# Altium schematic sheet 考勤机指纹密码锁部分原理图.SchDoc: 醉驾锁车系统接收原理图
size A4; PageSetup: Record=PageOptions|CenterHorizontal=True|CenterVertical=True|PrintScale=1.00|XCorrection=1.00|YCorrection=1.00|PrintKind=0|BorderSize=5000000|LeftOffset=0|BottomOffset=0|Orientation=2|PaperLength=1000|PaperWidth=1000|Scale=100|PaperSource=7|PrintQuality=-4|MediaType=1|DitherType=10|PaperKind=A4|PrintScaleMode=0; Time: 1
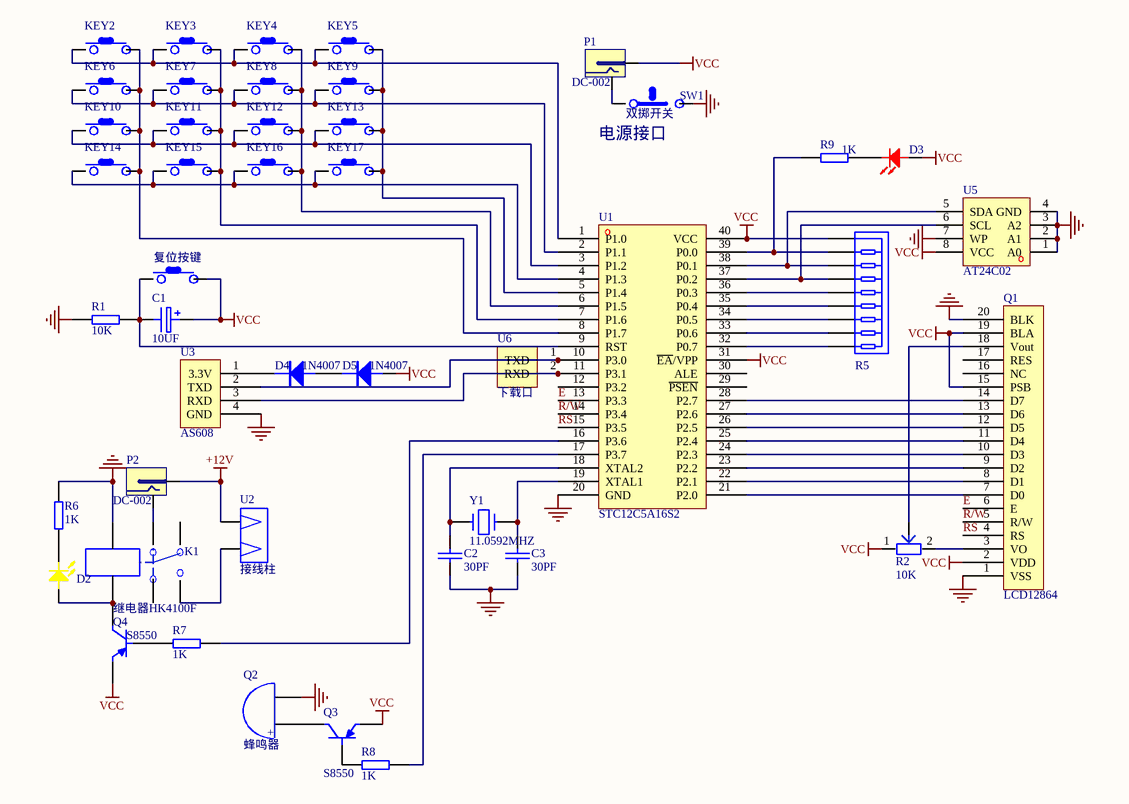
[diagram p0: 考勤机指纹密码锁部分原理图.SchDoc]

## Parts
C1  10UF  [CD4]
C2  30PF  [R38]
C3  30PF  [R38]
D2  LED-YELLOW  [LED-YELLOW]  (value not drawn)
D3  LED-RED  [LED-RED]  (value not drawn)
D4  1N4007  [DO-41]
D5  1N4007  [DO-41]
K1  继电器HK4100F  [HK4100F]
KEY1  复位按键  [SW]
KEY2  复位按键  [SW]  (value not drawn)
KEY3  复位按键  [SW]  (value not drawn)
KEY4  复位按键  [SW]  (value not drawn)
KEY5  复位按键  [SW]  (value not drawn)
KEY6  复位按键  [SW]  (value not drawn)
KEY7  复位按键  [SW]  (value not drawn)
KEY8  复位按键  [SW]  (value not drawn)
KEY9  复位按键  [SW]  (value not drawn)
KEY10  复位按键  [SW]  (value not drawn)
KEY11  复位按键  [SW]  (value not drawn)
KEY12  复位按键  [SW]  (value not drawn)
KEY13  复位按键  [SW]  (value not drawn)
KEY14  复位按键  [SW]  (value not drawn)
KEY15  复位按键  [SW]  (value not drawn)
KEY16  复位按键  [SW]  (value not drawn)
KEY17  复位按键  [SW]  (value not drawn)
P1  DC-002  [DC-002]
P2  DC-002  [DC-005]
Q1  LCD12864  [HDR20]
Q2  蜂鸣器  [蜂鸣器]
Q3  S8550  [三极管]
Q4  S8550  [三极管]
R1  10K  [AXIAL-0.4]
R2  10K  [Res-JT]
R5  10k  [R*9]  (value not drawn)
R6  1K  [AXIAL-0.3]
R7  1K  [AXIAL-0.3]
R8  1K  [AXIAL-0.3]
R9  1K  [AXIAL-0.3]
SW1  双掷开关  [SS12D07G5]
U1  STC12C5A16S2  [DIP40]
U2  接线柱  [XH2P]
U3  AS608  [XH4P]
U5  AT24C02  [DIP8]
U6  下载口  [HDR2]
Y1  11.0592MHZ  [XTAL]

## Nets
+12V: P2.1 U2.2
GND: C2.2 C3.1 K1.5 Q1.1(VSS) Q1.20(BLK) Q2.2 R1.1 R6.1 SW1.2 U1.20(GND) U3.4(GND) U5.1(A0) U5.2(A1) U5.3(A2) U5.4(GND) U5.7(WP)
VCC: C1.1 D3.1 D5.1 KEY1.2 P1.1 Q1.2(VDD) Q1.15(PSB) Q1.19(BLA) Q3.1(E) Q4.1(E) R2.1 R5.1 U1.31(~{EA}/VPP) U1.40(VCC) U5.8(VCC)
E: Q1.6(E) U1.13(P3.3)
R/W: Q1.5(R/W) U1.14(P3.4)
RS: Q1.4(RS) U1.15(P3.5)
NetC1_2: C1.2(E) KEY1.1 R1.2 U1.9(RST)
NetC2_1: C2.1 U1.18(XTAL2) Y1.2
NetC3_2: C3.2 U1.19(XTAL1) Y1.1
NetD2_1: D2.1 K1.2 Q4.3(C)
NetD2_2: D2.2 R6.2
NetD3_2: D3.2 R9.1
NetD4_1: D4.1 D5.2
NetD4_2: D4.2 U3.1(3.3V)
NetK1_4: K1.4 U2.1
NetK1_6: K1.6 P2.2
NetKEY2_1: KEY2.1 KEY3.1 KEY4.1 KEY5.1 U1.1(P1.0)
NetKEY2_2: KEY2.2 KEY6.2 KEY10.2 KEY14.2 U1.8(P1.7)
NetKEY3_2: KEY3.2 KEY7.2 KEY11.2 KEY15.2 U1.7(P1.6)
NetKEY4_2: KEY4.2 KEY8.2 KEY12.2 KEY16.2 U1.6(P1.5)
NetKEY5_2: KEY5.2 KEY9.2 KEY13.2 KEY17.2 U1.5(P1.4)
NetKEY6_1: KEY6.1 KEY7.1 KEY8.1 KEY9.1 U1.2(P1.1)
NetKEY10_1: KEY10.1 KEY11.1 KEY12.1 KEY13.1 U1.3(P1.2)
NetKEY14_1: KEY14.1 KEY15.1 KEY16.1 KEY17.1 U1.4(P1.3)
NetP1_2: P1.2 SW1.1
NetQ1_3: Q1.3(VO) R2.2
NetQ1_7: Q1.7(D0) U1.21(P2.0)
NetQ1_8: Q1.8(D1) U1.22(P2.1)
NetQ1_9: Q1.9(D2) U1.23(P2.2)
NetQ1_10: Q1.10(D3) U1.24(P2.3)
NetQ1_11: Q1.11(D4) U1.25(P2.4)
NetQ1_12: Q1.12(D5) U1.26(P2.5)
NetQ1_13: Q1.13(D6) U1.27(P2.6)
NetQ1_14: Q1.14(D7) U1.28(P2.7)
NetQ1_18: Q1.18(Vout) R2.3
NetQ2_1: Q2.1 Q3.3(C)
NetQ3_2: Q3.2(B) R8.1
NetQ4_2: Q4.2(B) R7.1
NetR5_2: R5.2 R9.2 U1.39(P0.0)
NetR5_3: R5.3 U1.38(P0.1) U5.5(SDA)
NetR5_4: R5.4 U1.37(P0.2) U5.6(SCL)
NetR5_5: R5.5 U1.36(P0.3)
NetR5_6: R5.6 U1.35(P0.4)
NetR5_7: R5.7 U1.34(P0.5)
NetR5_8: R5.8 U1.33(P0.6)
NetR5_9: R5.9 U1.32(P0.7)
NetR7_2: R7.2 U1.16(P3.6)
NetR8_2: R8.2 U1.17(P3.7)
NetU1_10: U1.10(P3.0) U3.2(TXD) U6.1(TXD)
NetU1_11: U1.11(P3.1) U3.3(RXD) U6.2(RXD)

Not connected (* = marked no-connect by the designer): K1 1 3; Q1 16(NC) 17(RES); U1 12(P3.2) 29(~{PSEN}) 30(ALE)

## Notes on the sheet
- (near SW1) 电源接口
- Title
- Size:
- Date:
- File:
- A0
- Number:
- Time:
- Revision:
- Sheet
- of
- (in symbol 蜂鸣器) +

## Library data of the parts
C1 = 电解电容
C2 C3 = 瓷片电容
KEY1-KEY17 = 微动开关
R1 R6-R9 = RES
R2 = 电位器
R5 = 排阻
U1 = STC89C52
Y1 = XTAL